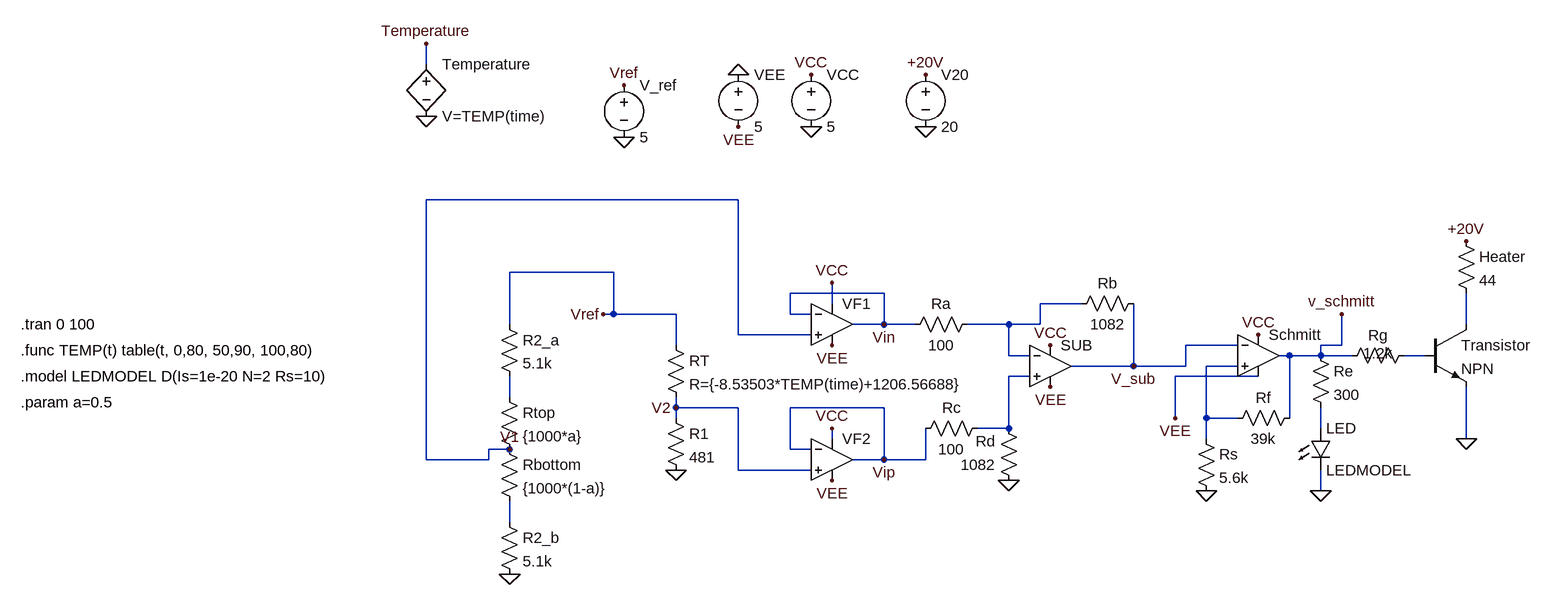
[diagram p0: schematic hysterisisHeater.asc]
hysterisisHeater.asc, the LTspice schematic file:
Version 4.1
SHEET 1 1408 680
WIRE -304 -336 -304 -368
WIRE 176 -128 -304 -128
WIRE -16 -16 -176 -16
WIRE 400 16 256 16
WIRE 320 32 320 0
WIRE 704 32 640 32
WIRE -16 48 -16 -16
WIRE -16 48 -32 48
WIRE 80 48 -16 48
WIRE 256 48 256 16
WIRE 288 48 256 48
WIRE -176 64 -176 -16
WIRE 400 64 400 16
WIRE 400 64 352 64
WIRE 448 64 400 64
WIRE 592 64 528 64
WIRE 640 64 640 32
WIRE 640 64 592 64
WIRE 1296 64 1296 16
WIRE 176 80 176 -128
WIRE 288 80 176 80
WIRE 80 96 80 48
WIRE 944 96 864 96
WIRE 1104 96 1104 48
WIRE 1104 96 1072 96
WIRE 592 112 592 64
WIRE 624 112 592 112
WIRE 1024 112 1008 112
WIRE 1072 112 1072 96
WIRE 1072 112 1024 112
WIRE 1120 112 1072 112
WIRE 1232 112 1200 112
WIRE 784 128 784 32
WIRE 784 128 688 128
WIRE 864 128 864 96
WIRE 864 128 784 128
WIRE 944 128 896 128
WIRE 624 144 592 144
WIRE 976 144 848 144
WIRE -176 176 -176 144
WIRE 80 192 80 176
WIRE 176 192 80 192
WIRE 400 192 256 192
WIRE 80 208 80 192
WIRE 848 208 848 144
WIRE 896 208 896 128
WIRE 944 208 896 208
WIRE 1024 208 1024 112
WIRE 592 224 592 144
WIRE 592 224 544 224
WIRE 1072 224 1072 192
WIRE 320 240 320 224
WIRE 896 240 896 208
WIRE 1296 240 1296 160
WIRE -176 256 -208 256
WIRE 256 256 256 192
WIRE 288 256 256 256
WIRE -304 272 -304 -128
WIRE -208 272 -208 256
WIRE -208 272 -304 272
WIRE 400 272 400 192
WIRE 400 272 352 272
WIRE 464 272 464 224
WIRE 464 272 400 272
WIRE 176 288 176 192
WIRE 288 288 176 288
WIRE 1072 320 1072 288
WIRE -176 368 -176 336
FLAG 80 192 V2
FLAG 288 -240 0
FLAG 288 -320 VCC
FLAG 320 0 VCC
FLAG 320 224 VCC
FLAG 176 -320 0
FLAG 176 -240 VEE
FLAG 0 -304 Vref
FLAG 0 -224 0
FLAG 320 96 VEE
FLAG 320 304 VEE
FLAG -32 48 Vref
FLAG 80 288 0
FLAG 400 64 Vin
FLAG 400 272 Vip
FLAG -176 448 0
FLAG -176 256 V1
FLAG 592 304 0
FLAG 656 160 VEE
FLAG 656 96 VCC
FLAG 784 128 V_sub
FLAG 896 320 0
FLAG 1072 320 0
FLAG 1296 240 0
FLAG 464 -240 0
FLAG 464 -320 +20V
FLAG 1296 -64 +20V
FLAG 976 80 VCC
FLAG 848 208 VEE
FLAG 1104 48 v_schmitt
FLAG -304 -256 0
FLAG -304 -368 Temperature
SYMBOL voltage 0 -320 R0
WINDOW 123 0 0 Left 0
WINDOW 39 0 0 Left 0
SYMATTR InstName V_ref
SYMATTR Value 5
SYMBOL res 64 80 R0
SYMATTR InstName RT
SYMATTR Value R={-8.53503*TEMP(time)+1206.56688}
SYMBOL res 64 192 R0
SYMATTR InstName R1
SYMATTR Value 481
SYMBOL OpAmps\\UniversalOpAmp2 320 64 R0
SYMATTR InstName VF1
SYMBOL OpAmps\\UniversalOpAmp2 320 272 R0
SYMATTR InstName VF2
SYMBOL OpAmps\\UniversalOpAmp2 656 128 R0
SYMATTR InstName SUB
SYMBOL OpAmps\\UniversalOpAmp2 976 112 R0
SYMATTR InstName Schmitt
SYMBOL voltage 288 -336 R0
SYMATTR InstName VCC
SYMATTR Value 5
SYMBOL voltage 176 -336 R0
SYMATTR InstName VEE
SYMATTR Value 5
SYMBOL res -192 48 R0
SYMATTR InstName R2_a
SYMATTR Value 5.1k
SYMBOL res -192 160 R0
SYMATTR InstName Rtop
SYMATTR Value {1000*a}
SYMBOL res -192 240 R0
SYMATTR InstName Rbottom
SYMATTR Value {1000*(1-a)}
SYMBOL res -192 352 R0
SYMATTR InstName R2_b
SYMATTR Value 5.1k
SYMBOL res 544 48 R90
WINDOW 0 0 56 VBottom 2
WINDOW 3 32 56 VTop 2
SYMATTR InstName Ra
SYMATTR Value 100
SYMBOL res 800 16 R90
WINDOW 0 0 56 VBottom 2
WINDOW 3 32 56 VTop 2
SYMATTR InstName Rb
SYMATTR Value 1082
SYMBOL res 608 320 R180
WINDOW 0 36 76 Left 2
WINDOW 3 36 40 Left 2
SYMATTR InstName Rd
SYMATTR Value 1082
SYMBOL res 560 208 R90
WINDOW 0 0 56 VBottom 2
WINDOW 3 32 56 VTop 2
SYMATTR InstName Rc
SYMATTR Value 100
SYMBOL res 880 224 R0
SYMATTR InstName Rs
SYMATTR Value 5.6k
SYMBOL res 1040 192 R90
WINDOW 0 0 56 VBottom 2
WINDOW 3 32 56 VTop 2
SYMATTR InstName Rf
SYMATTR Value 39k
SYMBOL res 1056 96 R0
SYMATTR InstName Re
SYMATTR Value 300
SYMBOL res 1216 96 R90
WINDOW 0 0 56 VBottom 2
WINDOW 3 28 56 VBottom 2
SYMATTR InstName Rg
SYMATTR Value 1.2k
SYMBOL npn3 1232 64 R0
SYMATTR InstName Transistor
SYMBOL res 1280 -80 R0
SYMATTR InstName Heater
SYMATTR Value 44
SYMBOL voltage 464 -336 R0
SYMATTR InstName V20
SYMATTR Value 20
SYMBOL LED 1056 224 R0
SYMATTR InstName LED
SYMATTR Value LEDMODEL
SYMBOL bv -304 -352 R0
SYMATTR InstName Temperature
SYMATTR Value V=TEMP(time)
TEXT -928 184 Left 2 !.param a=0.5
TEXT -928 144 Left 2 !.model LEDMODEL D(Is=1e-20 N=2 Rs=10)
TEXT -928 104 Left 2 !.func TEMP(t) table(t, 0,80, 50,90, 100,80)
TEXT -928 64 Left 2 !.tran 0 100

The netlist it stands for:
* hysterisisHeater.asc
V_ref Vref 0 5
RT Vref V2 R={-8.53503*TEMP(time)+1206.56688}
R1 V2 0 481
X§VF1 V1 Vin VCC VEE Vin level2 Avol=1Meg GBW=10Meg Slew=10Meg Ilimit=25m Rail=0 Vos=0 En=0 Enk=0 In=0 Ink=0 Rin=500Meg  ; pins In+ In- V+ V- OUT
X§VF2 V2 Vip VCC VEE Vip level2 Avol=1Meg GBW=10Meg Slew=10Meg Ilimit=25m Rail=0 Vos=0 En=0 Enk=0 In=0 Ink=0 Rin=500Meg  ; pins In+ In- V+ V- OUT
X§SUB N005 N001 VCC VEE V_sub level2 Avol=1Meg GBW=10Meg Slew=10Meg Ilimit=25m Rail=0 Vos=0 En=0 Enk=0 In=0 Ink=0 Rin=500Meg  ; pins In+ In- V+ V- OUT
X§Schmitt N004 V_sub VCC VEE v_schmitt level2 Avol=1Meg GBW=10Meg Slew=10Meg Ilimit=25m Rail=0 Vos=0 En=0 Enk=0 In=0 Ink=0 Rin=500Meg  ; pins In+ In- V+ V- OUT
VCC VCC 0 5
VEE 0 VEE 5
R2_a Vref N006 5.1k
Rtop N006 V1 {1000*a}
Rbottom V1 N008 {1000*(1-a)}
R2_b N008 0 5.1k
Ra N001 Vin 100
Rb V_sub N001 1082
Rd 0 N005 1082
Rc N005 Vip 100
Rs N004 0 5.6k
Rf v_schmitt N004 39k
Re v_schmitt N007 300
Rg N003 v_schmitt 1.2k
Q§Transistor N002 N003 0 0 NPN
R§Heater +20V N002 44
V20 +20V 0 20
D§LED N007 0 LEDMODEL
B§Temperature Temperature 0 V=TEMP(time)
.model D D
.lib standard.dio
.model NPN NPN
.model PNP PNP
.lib standard.bjt
.param a=0.5
.model LEDMODEL D(Is=1e-20 N=2 Rs=10)
.func TEMP(t) table(t, 0,80, 50,90, 100,80)
.tran 0 100
.lib UniversalOpAmp2.lib
.backanno
.end